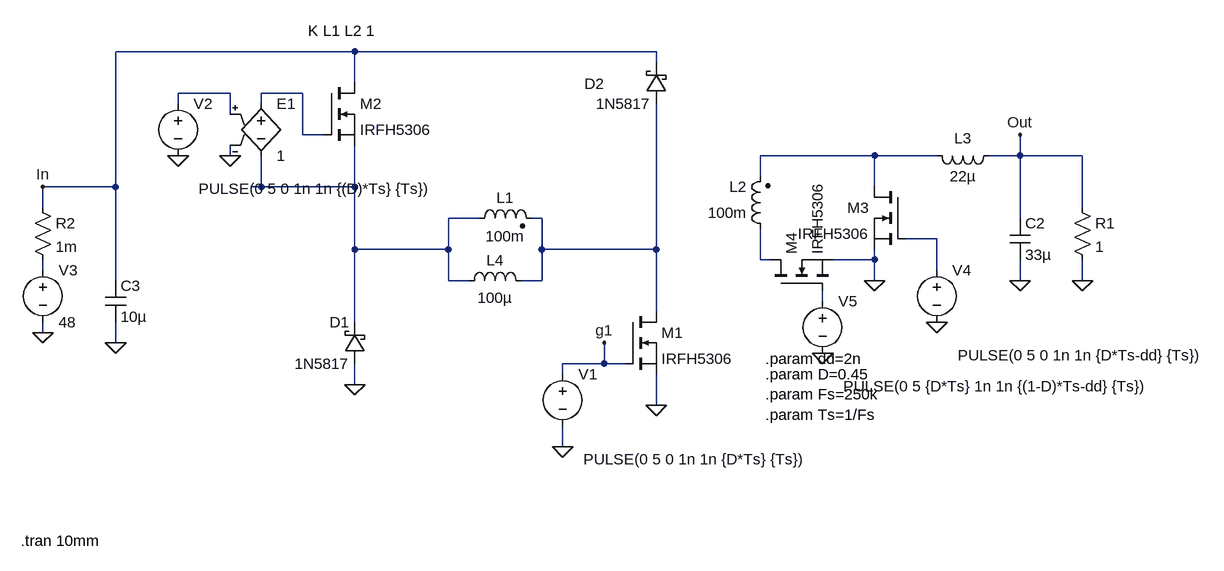
[diagram p0: schematic Two switches Forward Converter.asc]
Two switches Forward Converter.asc, the LTspice schematic file:
Version 4
SHEET 1 1576 680
WIRE -80 -320 -448 -320
WIRE 384 -320 -80 -320
WIRE 384 -304 384 -320
WIRE -80 -272 -80 -320
WIRE -272 -256 -352 -256
WIRE -160 -256 -224 -256
WIRE -352 -240 -352 -256
WIRE -224 -240 -224 -256
WIRE -272 -224 -272 -256
WIRE -160 -192 -160 -256
WIRE -128 -192 -160 -192
WIRE -272 -160 -272 -176
WIRE 720 -160 544 -160
WIRE 816 -160 720 -160
WIRE 944 -160 944 -192
WIRE 944 -160 896 -160
WIRE 1040 -160 944 -160
WIRE 544 -128 544 -160
WIRE -448 -112 -448 -320
WIRE -448 -112 -560 -112
WIRE -224 -112 -224 -160
WIRE -224 -112 -240 -112
WIRE -80 -112 -80 -176
WIRE -80 -112 -224 -112
WIRE 720 -112 720 -160
WIRE -560 -80 -560 -112
WIRE 1040 -80 1040 -160
WIRE 112 -64 64 -64
WIRE 208 -64 192 -64
WIRE 944 -64 944 -160
WIRE 816 -32 768 -32
WIRE -80 -16 -80 -112
WIRE 64 -16 64 -64
WIRE 64 -16 -80 -16
WIRE 208 -16 208 -64
WIRE 384 -16 384 -240
WIRE 384 -16 208 -16
WIRE 544 0 544 -48
WIRE 560 0 544 0
WIRE 720 0 720 -16
WIRE 720 0 656 0
WIRE -560 16 -560 0
WIRE 816 16 816 -32
WIRE -448 32 -448 -112
WIRE 64 32 64 -16
WIRE 96 32 64 32
WIRE 208 32 208 -16
WIRE 208 32 176 32
WIRE 720 32 720 0
WIRE 944 32 944 0
WIRE 1040 32 1040 0
WIRE 640 64 640 48
WIRE 384 80 384 -16
WIRE -80 96 -80 -16
WIRE -560 112 -560 96
WIRE -448 128 -448 96
WIRE 304 160 304 128
WIRE 304 160 240 160
WIRE 336 160 304 160
WIRE 240 176 240 160
WIRE -80 192 -80 160
WIRE 384 224 384 176
WIRE 240 288 240 256
FLAG 240 288 0
FLAG 384 224 0
FLAG 944 32 0
FLAG 720 32 0
FLAG 1040 32 0
FLAG 944 -192 Out
FLAG -560 -112 In
FLAG -560 112 0
FLAG -448 128 0
FLAG 304 128 g1
FLAG 816 96 0
FLAG 640 144 0
FLAG -80 192 0
FLAG -352 -160 0
FLAG -272 -160 0
SYMBOL nmos 336 80 R0
SYMATTR InstName M1
SYMATTR Value IRFH5306
SYMBOL voltage 240 160 R0
WINDOW 3 32 147 Left 2
WINDOW 123 0 0 Left 0
WINDOW 39 0 0 Left 0
SYMATTR InstName V1
SYMATTR Value PULSE(0 5 0 1n 1n {D*Ts} {Ts})
SYMBOL cap 928 -64 R0
SYMATTR InstName C2
SYMATTR Value 33µ
SYMBOL ind2 96 -48 R270
WINDOW 0 32 56 VTop 2
WINDOW 3 4 56 VBottom 2
SYMATTR InstName L1
SYMATTR Value 100m
SYMATTR Type ind
SYMBOL ind2 560 -32 R180
WINDOW 0 36 80 Left 2
WINDOW 3 36 40 Left 2
SYMATTR InstName L2
SYMATTR Value 100m
SYMATTR Type ind
SYMBOL ind 912 -176 R90
WINDOW 0 5 56 VBottom 2
WINDOW 3 32 56 VTop 2
SYMATTR InstName L3
SYMATTR Value 22µ
SYMATTR SpiceLine Ipk=40.6 Rser=0.00263 Rpar=7526 Cpar=13.756p mfg="Würth Elektronik" pn="7443763540220 WE-HCFT 3540"
SYMBOL res 1024 -96 R0
SYMATTR InstName R1
SYMATTR Value 1
SYMBOL voltage -560 0 R0
SYMATTR InstName V3
SYMATTR Value 48
SYMBOL res -576 -96 R0
SYMATTR InstName R2
SYMATTR Value 1m
SYMBOL cap -464 32 R0
SYMATTR InstName C3
SYMATTR Value 10µ
SYMBOL ind 80 48 R270
WINDOW 0 32 56 VTop 2
WINDOW 3 5 56 VBottom 2
SYMATTR InstName L4
SYMATTR Value 100µ
SYMBOL nmos 768 -112 M0
SYMATTR InstName M3
SYMATTR Value IRFH5306
SYMBOL voltage 816 0 R0
WINDOW 3 32 147 Left 2
WINDOW 123 0 0 Left 0
WINDOW 39 0 0 Left 0
SYMATTR InstName V4
SYMATTR Value PULSE(0 5 0 1n 1n {D*Ts-dd} {Ts})
SYMBOL nmos 560 48 R270
SYMATTR InstName M4
SYMATTR Value IRFH5306
SYMBOL voltage 640 48 R0
WINDOW 3 32 147 Left 2
WINDOW 123 0 0 Left 0
WINDOW 39 0 0 Left 0
SYMATTR InstName V5
SYMATTR Value PULSE(0 5 {D*Ts} 1n 1n {(1-D)*Ts-dd} {Ts})
SYMBOL schottky -64 160 R180
WINDOW 0 24 64 Left 2
WINDOW 3 24 0 Left 2
SYMATTR InstName D1
SYMATTR Value 1N5817
SYMATTR Description Diode
SYMATTR Type diode
SYMBOL schottky 400 -240 R180
WINDOW 0 96 31 Left 2
WINDOW 3 24 0 Left 2
SYMATTR InstName D2
SYMATTR Value 1N5817
SYMATTR Description Diode
SYMATTR Type diode
SYMBOL nmos -128 -272 R0
SYMATTR InstName M2
SYMATTR Value IRFH5306
SYMBOL voltage -352 -256 R0
WINDOW 3 32 147 Left 2
WINDOW 123 0 0 Left 0
WINDOW 39 0 0 Left 0
SYMATTR InstName V2
SYMATTR Value PULSE(0 5 0 1n 1n {(D)*Ts} {Ts})
SYMBOL e -224 -256 R0
SYMATTR InstName E1
SYMATTR Value 1
TEXT 552 176 Left 2 !.param D=0.45\n.param Fs=250k\n.param Ts=1/Fs
TEXT -152 -352 Left 2 !K L1 L2 1
TEXT -594 432 Left 2 !.tran 10mm
TEXT 552 152 Left 2 !.param dd=2n

The netlist it stands for:
* Two switches Forward Converter.asc
M1 N005 g1 0 0 IRFH5306
V1 g1 0 PULSE(0 5 0 1n 1n {D*Ts} {Ts})
C2 Out 0 33µ
L1 N004 N005 100m
L2 N007 N003 100m
L3 Out N003 22µ Ipk=40.6 Rser=0.00263 Rpar=7526 Cpar=13.756p mfg="Würth Elektronik" pn="7443763540220 WE-HCFT 3540"
R1 Out 0 1
V3 N008 0 48
R2 In N008 1m
C3 In 0 10µ
L4 N004 N005 100µ
M3 N003 N006 0 0 IRFH5306
V4 N006 0 PULSE(0 5 0 1n 1n {D*Ts-dd} {Ts})
M4 N007 N009 0 0 IRFH5306
V5 N009 0 PULSE(0 5 {D*Ts} 1n 1n {(1-D)*Ts-dd} {Ts})
D1 0 N004 1N5817
D2 N005 In 1N5817
M2 In N002 N004 N004 IRFH5306
V2 N001 0 PULSE(0 5 0 1n 1n {(D)*Ts} {Ts})
E1 N002 N004 N001 0 1
.model D D
.lib standard.dio
.model NMOS NMOS
.model PMOS PMOS
.lib standard.mos
.param D=0.45
.param Fs=250k
.param Ts=1/Fs
K L1 L2 1
.tran 10mm
.param dd=2n
.backanno
.end